# Altium schematic sheet Inner_Boost.SchDoc
size A
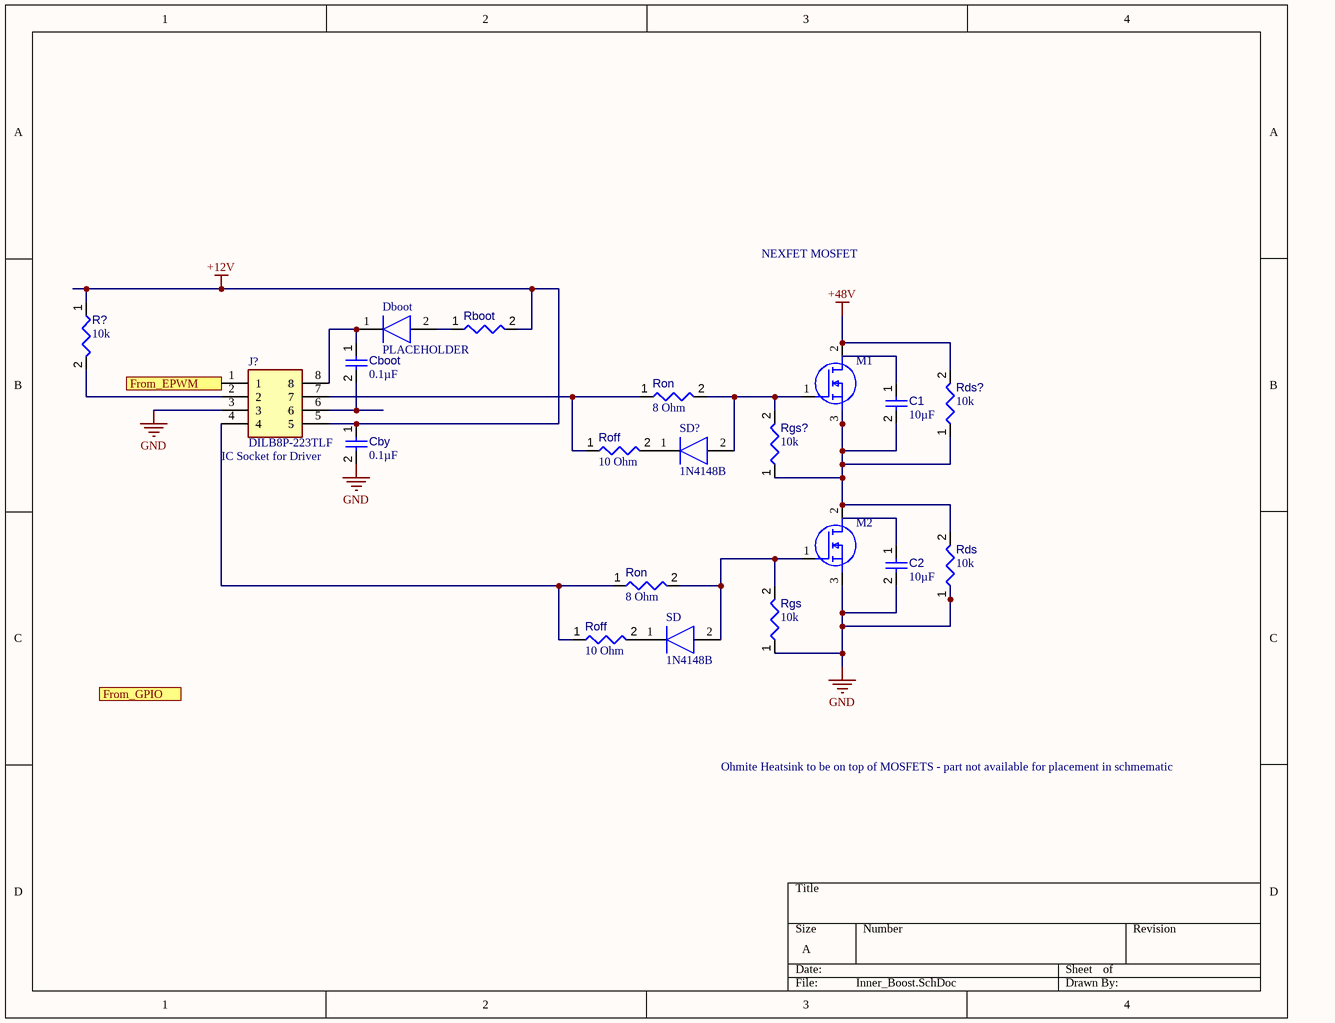
[diagram p0: Inner_Boost.SchDoc]

## Parts
(Parts that share a designator on the sheet are numbered #1, #2 ... from top to bottom, then left to right.)
C1  value 10µF  [CAPC0805(2012)145_L]  (hidden comment: Capacitor 10µF +/-20% 25V 0805)
C2  value 10µF  [CAPC0805(2012)145_L]  (hidden comment: Capacitor 10µF +/-20% 25V 0805)
Cboot  value 0.1µF  [CAPC1005X56X25LL10T15]  (hidden comment: Capacitor 0.1 uF +/- 5% 16 V 0402)
Cby  value 0.1µF  [CAPC1005X56X25LL10T15]  (hidden comment: Capacitor 0.1 uF +/- 5% 16 V 0402)
Dboot  PLACEHOLDER  [DIOAD990W55L340D162]
J?  DILB8P-223TLF  [DIPS762W60P254L1016H525Q8N]
M1  IRFB4615PBF  [TO254P483X1016X1994-3P]  (value not drawn)
M2  IRFB4615PBF  [TO254P483X1016X1994-3P]  (value not drawn)
R?  value 10k  [RESC0402(1005)_L]  (hidden comment: Resistor 10K  +/-1 % 0402 63 mW)
Rboot  Resistor 10k +/-1% 0603 100 mW  [RESC1608X55X25ML10T15]  (value not drawn)
Rds  value 10k  [RESC0402(1005)_L]  (hidden comment: Resistor 10K  +/-1 % 0402 63 mW)
Rds?  value 10k  [RESC0402(1005)_L]  (hidden comment: Resistor 10K  +/-1 % 0402 63 mW)
Rgs  value 10k  [RESC0402(1005)_L]  (hidden comment: Resistor 10K  +/-1 % 0402 63 mW)
Rgs?  value 10k  [RESC0402(1005)_L]  (hidden comment: Resistor 10K  +/-1 % 0402 63 mW)
Roff#1  value 10 Ohm  [RESC1608X55X25ML10T15]  (hidden comment: Resistor 10k +/-1% 0603 100 mW)
Roff#2  value 10 Ohm  [RESC1608X55X25ML10T15]  (hidden comment: Resistor 10k +/-1% 0603 100 mW)
Ron#1  value 8 Ohm  [RESC1608X55X25ML10T15]  (hidden comment: Resistor 10k +/-1% 0603 100 mW)
Ron#2  value 8 Ohm  [RESC1608X55X25ML10T15]  (hidden comment: Resistor 10k +/-1% 0603 100 mW)
SD  1N4148B  [DIOAD990W55L340D162]
SD?  1N4148B  [DIOAD990W55L340D162]

## Ports
From_EPWM (in), From_GPIO

## Nets
+12V: Cby.1 J?.5 R?.1 Rboot.2
+48V: M1.2(D) Rds?.2
GND: C2.2 Cby.2 J?.3 M2.3(S) Rds.1 Rgs.1
From_EPWM: J?.1 ; port From_EPWM
NetC1_2: C1.2 M1.3(S) M2.2(D) Rds.2 Rds?.1 Rgs?.1
NetCboot_1: Cboot.1 Dboot.1(K) J?.8
NetCboot_2: Cboot.2 J?.6
NetDboot_2: Dboot.2(A) Rboot.1
NetJ?_2: J?.2 R?.2
NetJ?_4: J?.4 Roff#2.1 Ron#2.1
NetJ?_7: J?.7 Roff#1.1 Ron#1.1
NetM1_1: M1.1(G) Rgs?.2 Ron#1.2 SD?.2(A)
NetM2_1: M2.1(G) Rgs.2 Ron#2.2 SD.2(A)
NetRoff#1_2: Roff#1.2 SD?.1(K)
NetRoff#2_2: Roff#2.2 SD.1(K)

Not connected (* = marked no-connect by the designer): C1 1; C2 1

## Notes on the sheet
- NEXFET MOSFET
- (near Cby) IC Socket for Driver
- Ohmite Heatsink to be on top of MOSFETS - part not available for placement in schmematic

## Library data of the parts
C1 C2 = CMP-001-00079-4: Chip Capacitor, 10µF +/-20%, 25V, 0805, Thickness 1.45 mm; Tolerance: 10%; Max Operating Temperature: 85°C; Case/Package: 0805; Voltage Rating: 25V; Min Operating Temperature: -55°C; Mounting Technology: SMT; Pins: 2
Cboot Cby = CMP-001-00001-6: Chip Capacitor, 0.1 uF, +/- 5%, 16 V, 0402 (1005 Metric); Capacitor Type: Ceramic; Voltage Rating: 16V; Max Operating Temperature: 125°C; Min Operating Temperature: -55°C; Case/Package: 0402; Mounting Technology: SM; Pins: 2; Tolerance: 5%; RoHS Compliant: True
Dboot SD SD? = 1N4148B: Diode; Manufacturer_Name: Vishay; Datasheet Link: https://www.vishay.com/docs/81857/1n4148.pdf; Manufacturer_Part_Number: 1N4148B
J? = DILB8P-223TLF: Connector; Manufacturer_Name: Amphenol; Datasheet Link: http://docs-emea.rs-online.com/webdocs/1451/0900766b8145144e.pdf; Height: 5.25mm; Manufacturer_Part_Number: DILB8P-223TLF; Mouser Part Number: 649-DILB8P223TLF; Mouser Price/Stock: https://www.mouser.co.uk/ProductDetail/Amphenol-FCI/DILB8P-223TLF/?qs=gISD9T5QW%2FAiSV%252BbCwW%2Fog%3D%3D; Arrow Part Number: DILB8P-223TLF; Arrow Price/Stock: https://www.arrow.com/en/products/dilb8p-223tlf/amphenol-fci
M1 M2 = IRFB4615PBF: MOSFET (N-Channel); Manufacturer_Name: Infineon; Datasheet Link: https://static6.arrow.com/aropdfconversion/fc085eb00e813bec65c58b34c53aeea1d8b02a1f/irfb4615pbf.pdf; Height: 4.83mm; Manufacturer_Part_Number: IRFB4615PBF; Mouser Part Number: 942-IRFB4615PBF; Mouser Price/Stock: https://www.mouser.co.uk/ProductDetail/Infineon-Technologies/IRFB4615PBF?qs=9%252BKlkBgLFf20BbweusQYXA%3D%3D; Arrow Part Number: IRFB4615PBF; Arrow Price/Stock: https://www.arrow.com/en/products/irfb4615pbf/infineon-technologies-ag
R? Rds Rds? Rgs Rgs? = CMP-009-00149-3: Chip Resistor, 10 kOhms, +/-1 %, 63 mW, -55 to 125 degC, 0402; Power: 63mW; Tolerance: 1%; Min Operating Temperature: -55°C; Case/Package: 0402; Max Operating Temperature: 155°C; Pins: 2
Rboot Roff#1 Roff#2 Ron#1 Ron#2 = CMP-009-00017-5: Chip Resistor, 10 KOhm, +/- 1%, 01 W, -55 to 155 degC, 0603 (1608 Metric); Voltage Rating: 50V; Power: 100mW; RoHS Compliant: True; Min Operating Temperature: -55°C; Pins: 2; Case/Package: 0603; Mounting Technology: SM; Max Operating Temperature: 155°C; Tolerance: 1%